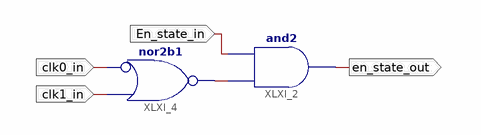
[diagram p0: schematic sheet 1]
// Xilinx ISE schematic ranger_rd.sch (spartan3e) as structural Verilog: 2 symbols, 4 ports
module ranger_rd (
  input  clk0_in,
  input  clk1_in,
  input  En_state_in,
  output en_state_out
);

  wire XLXN_3;

  and XLXI_2 (en_state_out, XLXN_3, En_state_in);
  nor XLXI_4 (XLXN_3, ~clk0_in, clk1_in);  // nor2b1
endmodule
